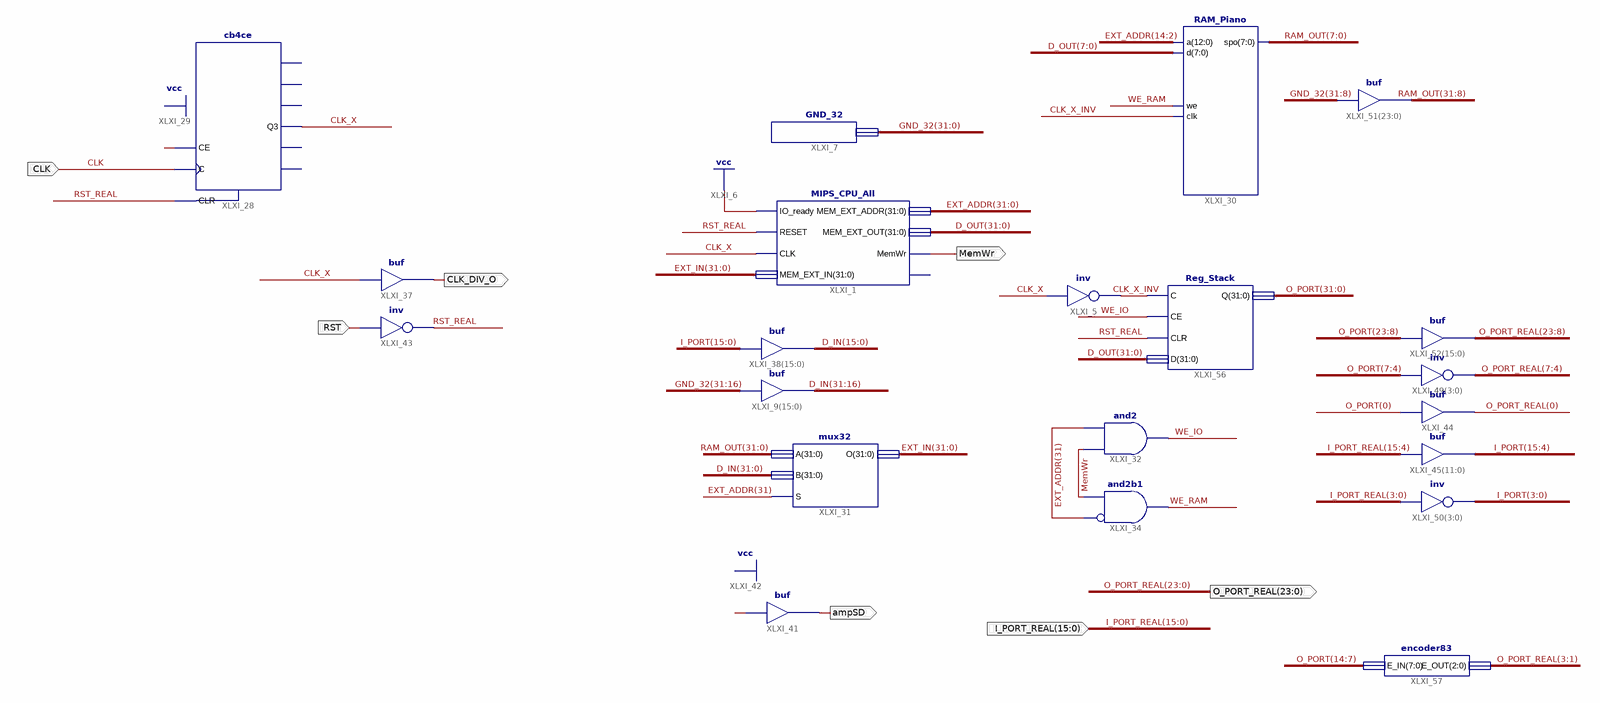
[diagram p0: schematic sheet 1]
// Xilinx ISE schematic CPU_Piano.sch (artix7) as structural Verilog: 21 symbols, 7 ports
module CPU_Piano (
  input  CLK,
  input  RST,
  input  [15:0] I_PORT_REAL,
  output MemWr,
  output CLK_DIV_O,
  output ampSD,
  output [23:0] O_PORT_REAL
);

  wire CLK_X, CLK_X_INV, RST_REAL, WE_IO, WE_RAM;
  wire [15:0] I_PORT;
  wire [31:0] D_IN, D_OUT, EXT_ADDR, EXT_IN, GND_32, O_PORT, RAM_OUT;

  MIPS_CPU_All XLXI_1 (
    .CLK(CLK_X), .IO_ready(1'b1), .MemWr(MemWr), .MEM_EXT_ADDR(EXT_ADDR), .MEM_EXT_IN(EXT_IN),
    .MEM_EXT_OUT(D_OUT), .RESET(RST_REAL));  // open: On_IO
  GND_32 XLXI_7 (.GND_OUT(GND_32));
  assign D_IN[31:16] = GND_32[31:16];  // buf XLXI_9[15..0], 16 bits wide
  cb4ce XLXI_28 (.C(CLK), .CE(1'b1), .CLR(RST_REAL), .Q3(CLK_X));  // open: CEO, Q0, Q1, Q2, TC
  RAM_Piano XLXI_30 (.a(EXT_ADDR[14:2]), .d(D_OUT[7:0]), .we(WE_RAM), .clk(CLK_X_INV), .spo(RAM_OUT[7:0]));
  mux32 XLXI_31 (.A(RAM_OUT), .B(D_IN), .S(EXT_ADDR[31]), .O(EXT_IN));
  and XLXI_32 (WE_IO, MemWr, EXT_ADDR[31]);
  and XLXI_34 (WE_RAM, ~EXT_ADDR[31], MemWr);  // and2b1
  buf XLXI_37 (CLK_DIV_O, CLK_X);
  assign D_IN[15:0] = I_PORT;  // buf XLXI_38[15..0], 16 bits wide
  buf XLXI_41 (ampSD, 1'b1);
  not XLXI_43 (RST_REAL, RST);
  buf XLXI_44 (O_PORT_REAL[0], O_PORT[0]);
  assign I_PORT[15:4] = I_PORT_REAL[15:4];  // buf XLXI_45[11..0], 12 bits wide
  assign O_PORT_REAL[7:4] = ~O_PORT[7:4];  // inv XLXI_49[3..0], 4 bits wide
  assign I_PORT[3:0] = ~I_PORT_REAL[3:0];  // inv XLXI_50[3..0], 4 bits wide
  assign RAM_OUT[31:8] = GND_32[31:8];  // buf XLXI_51[23..0], 24 bits wide
  assign O_PORT_REAL[23:8] = O_PORT[23:8];  // buf XLXI_52[15..0], 16 bits wide
  not XLXI_5 (CLK_X_INV, CLK_X);
  Reg_Stack XLXI_56 (.C(CLK_X_INV), .CE(WE_IO), .CLR(RST_REAL), .D(D_OUT), .Q(O_PORT));
  encoder83 XLXI_57 (.E_IN(O_PORT[14:7]), .E_OUT(O_PORT_REAL[3:1]));
endmodule
